# Altium schematic sheet Strain To Digital.SchDoc
size A4; SheetNumber: 7; SheetTotal: 9
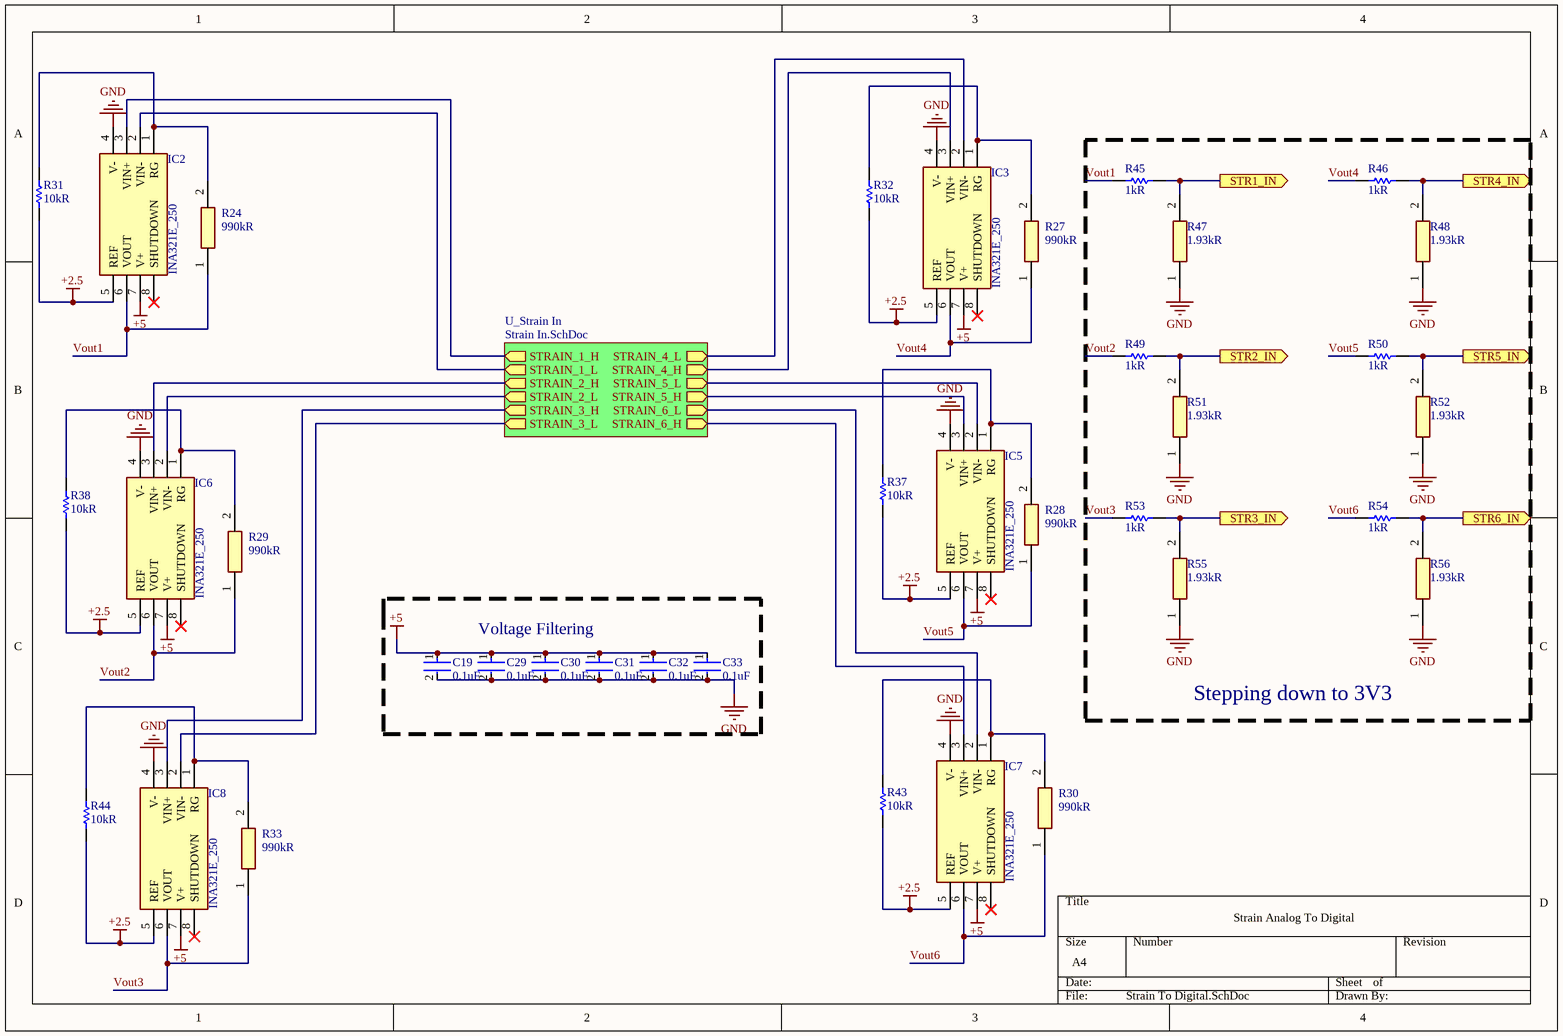
[diagram p0: Strain To Digital.SchDoc]

## Parts
C19  0.1uF  [FP-CC0402-MFG]
C29  0.1uF  [FP-CC0402-MFG]
C30  0.1uF  [FP-CC0402-MFG]
C31  0.1uF  [FP-CC0402-MFG]
C32  0.1uF  [FP-CC0402-MFG]
C33  0.1uF  [FP-CC0402-MFG]
IC2  INA321E_250  [SOP65P490X110-8N]
IC3  INA321E_250  [SOP65P490X110-8N]
IC5  INA321E_250  [SOP65P490X110-8N]
IC6  INA321E_250  [SOP65P490X110-8N]
IC7  INA321E_250  [SOP65P490X110-8N]
IC8  INA321E_250  [SOP65P490X110-8N]
R24  990kR  [RESC3216X84N]
R27  990kR  [RESC3216X84N]
R28  990kR  [RESC3216X84N]
R29  990kR  [RESC3216X84N]
R30  990kR  [RESC3216X84N]
R31  10kR  [RESC1608X55X30ML20T20]
R32  10kR  [RESC1608X55X30ML20T20]
R33  990kR  [RESC3216X84N]
R37  10kR  [RESC1608X55X30ML20T20]
R38  10kR  [RESC1608X55X30ML20T20]
R43  10kR  [RESC1608X55X30ML20T20]
R44  10kR  [RESC1608X55X30ML20T20]
R45  1kR  [RESC2013X50X30NL20T20]
R46  1kR  [RESC2013X50X30NL20T20]
R47  1.93kR  [TNPW04021K93BEED]
R48  1.93kR  [TNPW04021K93BEED]
R49  1kR  [RESC2013X50X30NL20T20]
R50  1kR  [RESC2013X50X30NL20T20]
R51  1.93kR  [TNPW04021K93BEED]
R52  1.93kR  [TNPW04021K93BEED]
R53  1kR  [RESC2013X50X30NL20T20]
R54  1kR  [RESC2013X50X30NL20T20]
R55  1.93kR  [TNPW04021K93BEED]
R56  1.93kR  [TNPW04021K93BEED]

## Blocks framed on the sheet
Stepping down to 3V3: R45-R56
Voltage Filtering: C19 C29-C33

## Sub-sheets
U_Strain In = Strain In.SchDoc: STRAIN_1_L (out), STRAIN_1_H (out), STRAIN_2_L (out), STRAIN_2_H (out), STRAIN_3_H (out), STRAIN_3_L (out), STRAIN_4_H (out), STRAIN_4_L (out), STRAIN_5_H (out), STRAIN_5_L (out), STRAIN_6_H (out), STRAIN_6_L (out)

## Ports
STR1_IN (out), STR2_IN (out), STR3_IN (out), STR4_IN (out), STR5_IN (out), STR6_IN (out)

## Nets
+2.5: IC2.5(REF) IC3.5(REF) IC5.5(REF) IC6.5(REF) IC7.5(REF) IC8.5(REF) R31.2 R32.2 R37.2 R38.2 R43.2 R44.2
+5: C19.1 C29.1 C30.1 C31.1 C32.1 C33.1 IC2.7(V+) IC3.7(V+) IC5.7(V+) IC6.7(V+) IC7.7(V+) IC8.7(V+)
GND: C19.2 C29.2 C30.2 C31.2 C32.2 C33.2 IC2.4(V-) IC3.4(V-) IC5.4(V-) IC6.4(V-) IC7.4(V-) IC8.4(V-) R47.1 R48.1 R51.1 R52.1 R55.1 R56.1
STR1_IN: R45.2 R47.2 ; port STR1_IN
STR2_IN: R49.2 R51.2 ; port STR2_IN
STR3_IN: R53.2 R55.2 ; port STR3_IN
STR4_IN: R46.2 R48.2 ; port STR4_IN
STR5_IN: R50.2 R52.2 ; port STR5_IN
STR6_IN: R54.2 R56.2 ; port STR6_IN
Vout1: IC2.6(VOUT) R24.1 R45.1
Vout2: IC6.6(VOUT) R29.1 R49.1
Vout3: IC8.6(VOUT) R33.1 R53.1
Vout4: IC3.6(VOUT) R27.1 R46.1
Vout5: IC5.6(VOUT) R28.1 R50.1
Vout6: IC7.6(VOUT) R30.1 R54.1
NetIC2_1: IC2.1(RG) R24.2 R31.1
NetIC2_2: IC2.2(VIN-) ; sheet U_Strain In/STRAIN_1_L
NetIC2_3: IC2.3(VIN+) ; sheet U_Strain In/STRAIN_1_H
NetIC3_1: IC3.1(RG) R27.2 R32.1
NetIC3_2: IC3.2(VIN-) ; sheet U_Strain In/STRAIN_4_L
NetIC3_3: IC3.3(VIN+) ; sheet U_Strain In/STRAIN_4_H
NetIC5_1: IC5.1(RG) R28.2 R37.1
NetIC5_2: IC5.2(VIN-) ; sheet U_Strain In/STRAIN_5_L
NetIC5_3: IC5.3(VIN+) ; sheet U_Strain In/STRAIN_5_H
NetIC6_1: IC6.1(RG) R29.2 R38.1
NetIC6_2: IC6.2(VIN-) ; sheet U_Strain In/STRAIN_2_L
NetIC6_3: IC6.3(VIN+) ; sheet U_Strain In/STRAIN_2_H
NetIC7_1: IC7.1(RG) R30.2 R43.1
NetIC7_2: IC7.2(VIN-) ; sheet U_Strain In/STRAIN_6_L
NetIC7_3: IC7.3(VIN+) ; sheet U_Strain In/STRAIN_6_H
NetIC8_1: IC8.1(RG) R33.2 R44.1
NetIC8_2: IC8.2(VIN-) ; sheet U_Strain In/STRAIN_3_L
NetIC8_3: IC8.3(VIN+) ; sheet U_Strain In/STRAIN_3_H

Not connected (* = marked no-connect by the designer): IC2 8(SHUTDOWN)*; IC3 8(SHUTDOWN)*; IC5 8(SHUTDOWN)*; IC6 8(SHUTDOWN)*; IC7 8(SHUTDOWN)*; IC8 8(SHUTDOWN)*

## Notes on the sheet
- Strain Analog To Digital

## Library data of the parts
C19 C29-C33 = CMP-03422-000048-1: CAP CER 0.1UF 16V X7R 0402; Manufacturer: YAGEO; Manufacturer Part Number: CC0402KRX7R7BB104; Material: Ceramic; Automotive Grade: NA; Capacitance: 100 nF; Temperature Coefficient: 30ppm/°C; Tolerance: 0.1; Value: 100 nF; Device Class L1: Passive Components; Temperature Range Low: -55°C; Device Class L3: Ceramic Capacitors; Temperature Characteristic: X7R; Ipc Land Pattern Name: CAPC10050X50; Temperature Range High: +125°C; Voltage Rating: 16 V; Temperature: -55°C to +125°C; RoHS: TRUE; Automotive: No; Height: 0.55mm; Device Class L2: Capacitors; Digikey Description: CAP CER 0.1UF 16V X7R 0402; Package: CC0402; Footprint Url: http://www.yageo.com/exep/pages/download/literatures/UPY-C_GEN_24.pdf; ComponentLink2Description: Datasheet; Category: Cap; Lead Free: Yes; Octopart: https://octopart.com/cc0402krx7r7bb104-yageo-42244624; ComponentLink2URL: http://www.yageo.com/documents/recent/UPY-GP_NP0_16V-to-50V_16.pdf; Mouser Description: 0402 0.1 uF 16 V ±10 % Tolerance X7R SMT Multilayer Ceramic Capacitor
IC2 IC3 IC5-IC8 = INA321E_250: Integrated Circuit; Manufacturer_Name: Texas Instruments; Manufacturer_Part_Number: INA321E/250; Datasheet Link: http://www.ti.com/lit/gpn/INA321; Height: 1.1mm
R24 R27-R30 R33 = PTN1206E9903BST1: Resistor; Manufacturer_Name: Vishay; Datasheet Link: http://www.vishay.com/docs/60026/ptn.pdf; Height: 0.838mm; Manufacturer_Part_Number: PTN1206E9903BST1
R31 R32 R37 R38 R43 R44 = CMP-2000-00874-1: Part Number: ERA-3AEB103V; Manufacturer: Panasonic
R45 R46 R49 R50 R53 R54 = CMP-1013-00510-2: Part Number: CRCW08051K00FKEA; Manufacturer: Vishay Dale
R47 R48 R51 R52 R55 R56 = TNPW04021K93BEED: Resistor; Manufacturer_Name: ROHM Semiconductor; Manufacturer_Part_Number: KTR10EZPF1694; Datasheet Link: http://rohmfs.rohm.com/en/products/databook/datasheet/passive/resistor/chip_resistor/ktr.pdf; Height: 0.65mm